# EasyEDA Pro project ProPrj_AS5047P磁编码器板(For3505电机_2026-04-13.epro

# Schematic Schematic1
Board Name: Board1; Create Date: 2024-10-22; Page Name: P1; Project Name: AS5047P磁编码器板(For3505电机; Schematic Name: Schematic1; Update Date: 2024-10-22; Company: 嘉立创EDA; Page Size: A4; Version: V1.0
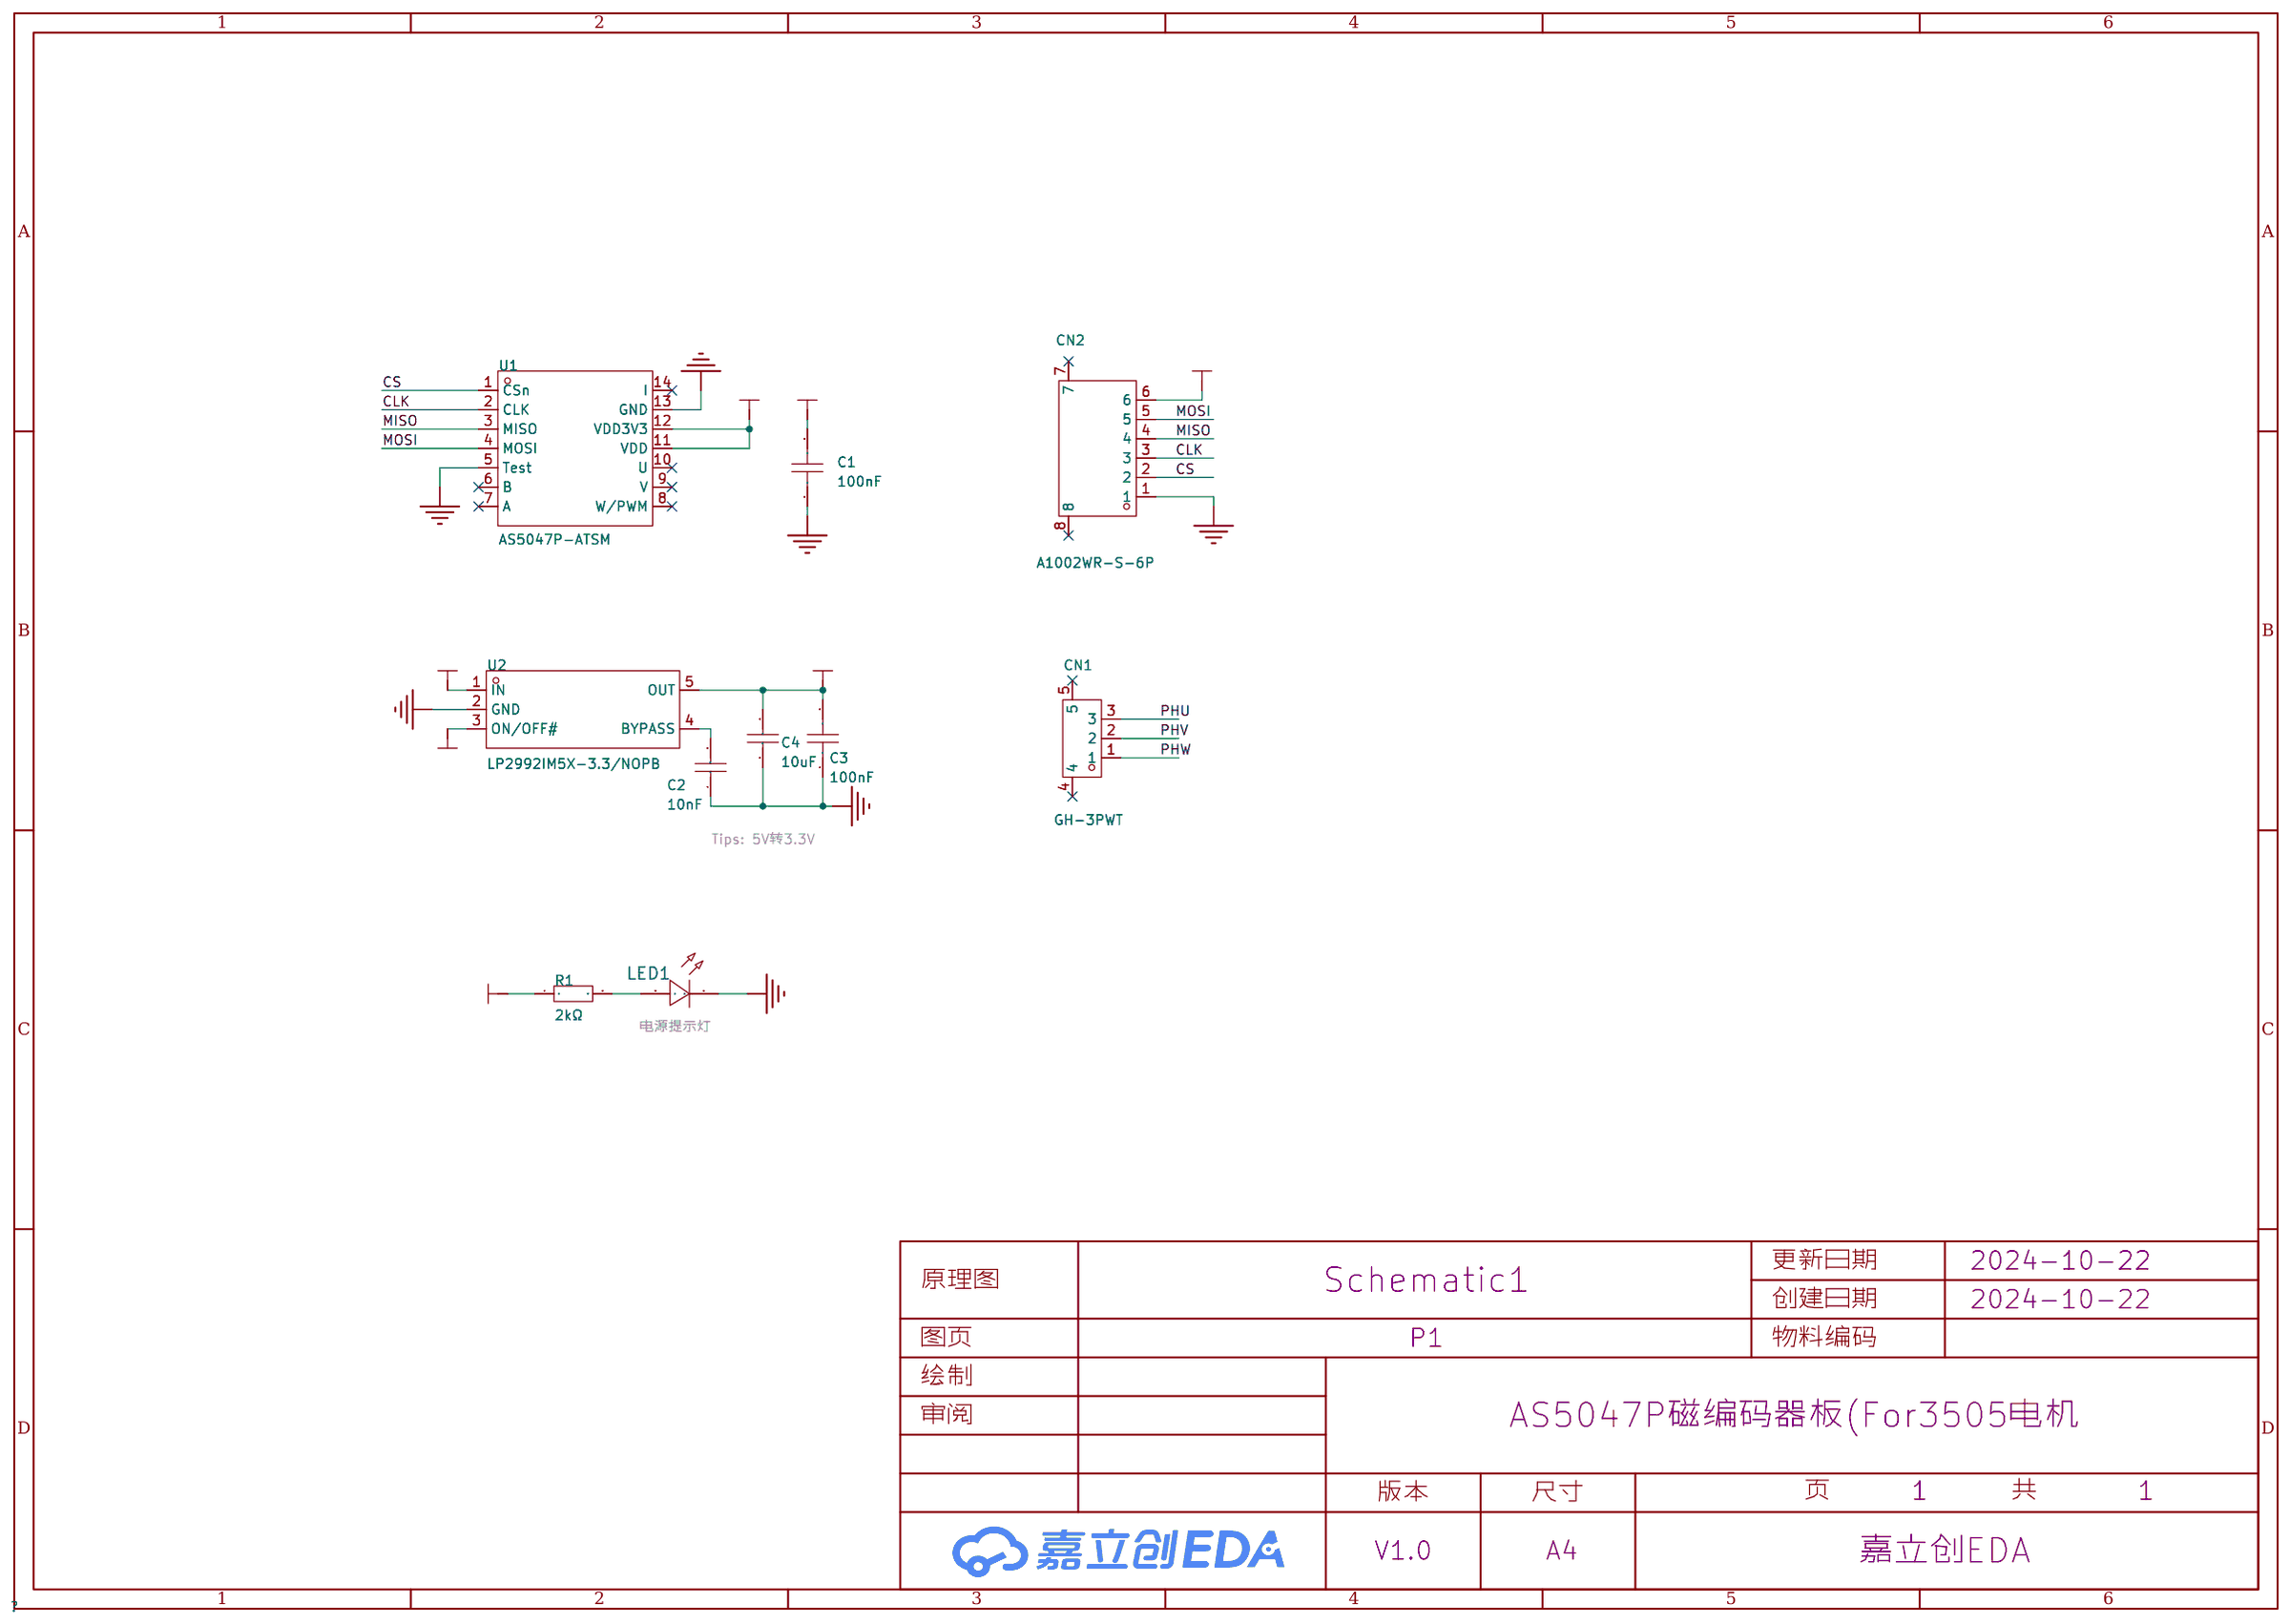
[diagram p0: schematic sheet]

## Parts
C1  100nF  [C0402]
C2  10nF  [C0402]
C3  100nF  [C0402]
C4  10uF  [C0402]
CN1  GH-3PWT  [conn-smd_gh-3pwt]
CN2  A1002WR-S-6P  [CONN-SMD_A1002WR-S-6P]
LED1  -  [LED_0603]
R1  2kΩ  [R0402]
U1  AS5047P-ATSM  [TSSOP-14_L5.0-W4.4-P0.65-LS6.4-BL]
U2  LP2992IM5X-3.3/NOPB  [SOT-23-5_L2.9-W1.6-P0.95-LS2.8-BR]

## Library data of the parts
C1 C3 = CL05B104KO5NNNC: 容值:100nF;精度:±10%;额定电压:16V;材质(温度系数):X7R;; LCSC Part Name: 100nF ±10% 16V; Supplier Part: C1525; Manufacturer: SAMSUNG(三星); Supplier Footprint: 0402; JLCPCB Part Class: 基础库; Datasheet: https://atta.szlcsc.com/upload/public/pdf/source/20160218/1457707763339.pdf; Supplier: LCSC; Tolerance: ±10%; Voltage Rated: 16V; Temperature Coefficient: X7R
C2 = CL05B103KB5NNNC: 容值:10nF;精度:±10%;额定电压:50V;材质(温度系数):X7R;; LCSC Part Name: 10nF ±10% 50V; Supplier Part: C15195; Manufacturer: SAMSUNG(三星); Supplier Footprint: 0402; Datasheet: https://atta.szlcsc.com/upload/public/pdf/source/20160218/1457707763339.pdf; Supplier: LCSC; Tolerance: ±10%; Voltage Rated: 50V; Temperature Coefficient: X7R
C4 = CL05A106MQ5NUNC: 容值:10uF;精度:±20%;额定电压:6.3V;材质(温度系数):X5R;; LCSC Part Name: 10uF ±20% 6.3V; Supplier Part: C15525; Manufacturer: SAMSUNG(三星); Supplier Footprint: 0402; JLCPCB Part Class: 基础库; Datasheet: https://atta.szlcsc.com/upload/public/pdf/source/20220823/2B02EE04F8F211D38A52DCB16EB6BEBA.pdf; Supplier: LCSC; Tolerance: ±20%; Voltage Rated: 6.3V; Temperature Coefficient: X5R
CN1 = GH-3PWT: LCSC Part Name: 3P 1.25mm; Supplier Part: C2763649; Manufacturer: FG(富港); Supplier Footprint: SMD; JLCPCB Part Class: 扩展库; Datasheet: https://atta.szlcsc.com/upload/public/pdf/source/20210407/C2763648_564FED8A0440C1CEC0901E8305E0E977.pdf; Supplier: LCSC
CN2 = A1002WR-S-6P: 参考系列:SH;间距:1mm;插针结构:1x6P;排数:1;每排PIN数:6;行距:-;安装方式:-;触头材质:磷青铜;; LCSC Part Name: SH 1mm 1x6P; Supplier Part: C239524; Manufacturer: CJT(长江连接器); Supplier Footprint: SMD,P=1mm; JLCPCB Part Class: 扩展库; Datasheet: https://atta.szlcsc.com/upload/public/pdf/source/20190523/C338919_26A19BC9BEDA3DBF5CB743676AAF20C3.pdf; Supplier: LCSC; Reference Series: SH; Pitch: 1mm; Pins Structure: 1x6P; Number of Rows: 1; Number of PINs Per Row: 6; Contact Material: 磷青铜
LED1 = LED_0603-R: Supplier Footprint: 0603
R1 = 0402WGF2001TCE: 电阻类型:厚膜电阻;阻值:2kΩ;精度:±1%;功率:62.5mW;最大工作电压:50V;温度系数:±100ppm/℃;; LCSC Part Name: 2kΩ ±1% 62.5mW 厚膜电阻; Supplier Part: C4109; Manufacturer: UNI-ROYAL(厚声); Supplier Footprint: 0402; JLCPCB Part Class: 基础库; Datasheet: https://atta.szlcsc.com/upload/public/pdf/source/20200306/C422600_1E6D84923E4A46A82E41ADD87F860B5C.pdf; Supplier: LCSC; Type: 厚膜电阻; Tolerance: ±1%; Power(Watts): 62.5mW; Overload Voltage (Max): 50V; Temperature Coefficient: ±100ppm/℃; Operating Temperature Range: -55℃~+155℃
U1 = AS5047P-ATSM_C962063: Supplier Part: C962063; Manufacturer: ams(艾迈斯半导体); Supplier Footprint: TSSOP-14; JLCPCB Part Class: 扩展库; Datasheet: https://atta.szlcsc.com/upload/public/pdf/source/20230424/95EDFD761CCFD379FE860E4B35935AF0.pdf; Supplier: LCSC
U2 = LP2992IM5X-3.3/NOPB: 微功耗 250mA 低噪声超低压降稳压器 5-SOT-23 -40 to 125; Supplier Part: C2877731; Manufacturer: TI(德州仪器); Supplier Footprint: SOT-23-5; JLCPCB Part Class: 扩展库; Datasheet: https://atta.szlcsc.com/upload/public/pdf/source/20230221/4F3FB37702A60F10FC19CD69011A6AB4.pdf; Supplier: LCSC

## Nets
3.3V: C1.2 C3.2 C4.2 R1.1 U1.11(VDD) U1.12(VDD3V3) U2.5(OUT)
5V: CN2.6 U2.1(IN) U2.3(ON/OFF#)
GND: C1.1 C2.1 C3.1 C4.1 CN2.1 LED1.1(C) U1.5(Test) U1.13(GND) U2.2(GND)
CLK: CN2.3 U1.2(CLK)
CS: CN2.2 U1.1(CSn)
MISO: CN2.4 U1.3(MISO)
MOSI: CN2.5 U1.4(MOSI)
PHU: CN1.3
PHV: CN1.2
PHW: CN1.1
$1N873: C2.2 U2.4(BYPASS)
$1N1089: LED1.2(A) R1.2

Not connected (* = marked no-connect by the designer): CN1 4* 5*; CN2 7* 8*; U1 6(B)* 7(A)* 8(W/PWM)* 9(V)* 10(U)* 14(I)*

## Notes on the sheet
- Tips: 5V转3.3V
- 电源提示灯

# Schematic Schematic2
Board Name: Board1; Create Date: 2024-10-22; Page Name: P1; Project Name: AS5047P磁编码器板(For3505电机; Schematic Name: Schematic1; Update Date: 2024-10-22; Company: 嘉立创EDA; Page Size: A4; Version: V1.0
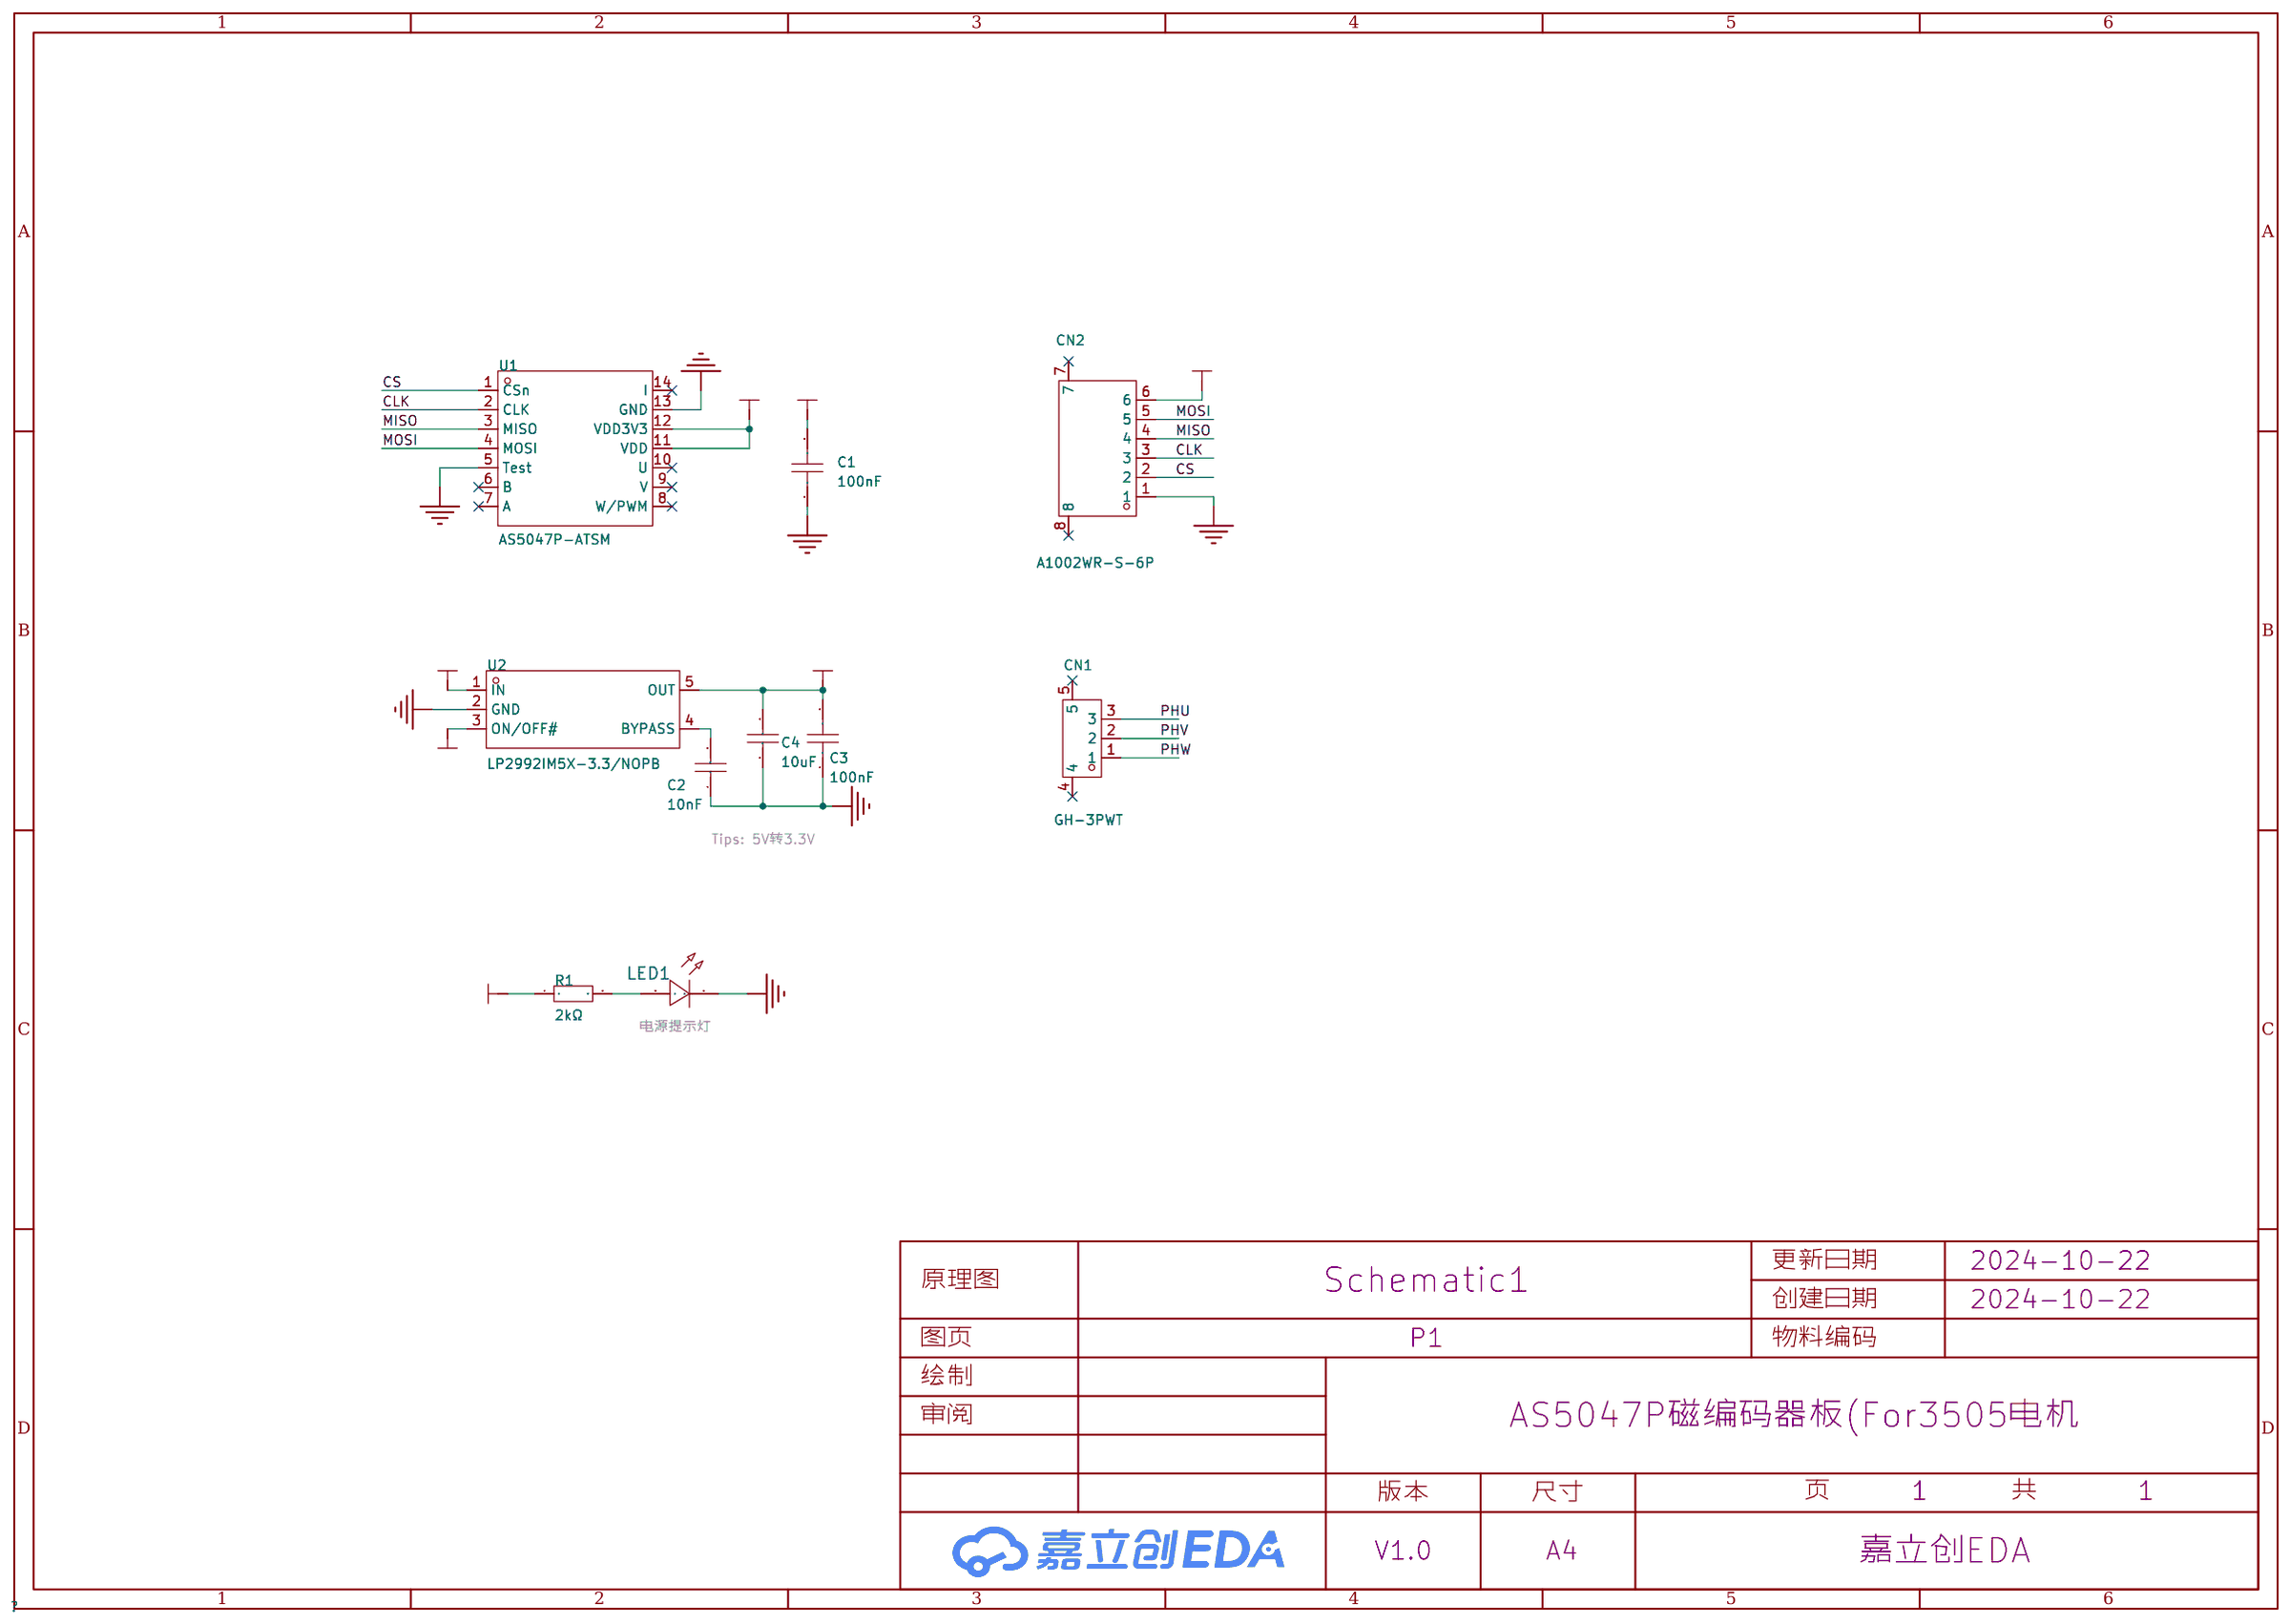
[diagram p1: schematic sheet]

## Parts
C1  100nF  [C0402]
C2  10nF  [C0402]
C3  100nF  [C0402]
C4  10uF  [C0402]
CN1  GH-3PWT  [conn-smd_gh-3pwt]
CN2  A1002WR-S-6P  [CONN-SMD_A1002WR-S-6P]
LED1  -  [LED_0603]
R1  2kΩ  [R0402]
U1  AS5047P-ATSM  [TSSOP-14_L5.0-W4.4-P0.65-LS6.4-BL]
U2  LP2992IM5X-3.3/NOPB  [SOT-23-5_L2.9-W1.6-P0.95-LS2.8-BR]

## Library data of the parts
C1 C3 = CL05B104KO5NNNC: 容值:100nF;精度:±10%;额定电压:16V;材质(温度系数):X7R;; LCSC Part Name: 100nF ±10% 16V; Supplier Part: C1525; Manufacturer: SAMSUNG(三星); Supplier Footprint: 0402; JLCPCB Part Class: 基础库; Datasheet: https://atta.szlcsc.com/upload/public/pdf/source/20160218/1457707763339.pdf; Supplier: LCSC; Tolerance: ±10%; Voltage Rated: 16V; Temperature Coefficient: X7R
C2 = CL05B103KB5NNNC: 容值:10nF;精度:±10%;额定电压:50V;材质(温度系数):X7R;; LCSC Part Name: 10nF ±10% 50V; Supplier Part: C15195; Manufacturer: SAMSUNG(三星); Supplier Footprint: 0402; Datasheet: https://atta.szlcsc.com/upload/public/pdf/source/20160218/1457707763339.pdf; Supplier: LCSC; Tolerance: ±10%; Voltage Rated: 50V; Temperature Coefficient: X7R
C4 = CL05A106MQ5NUNC: 容值:10uF;精度:±20%;额定电压:6.3V;材质(温度系数):X5R;; LCSC Part Name: 10uF ±20% 6.3V; Supplier Part: C15525; Manufacturer: SAMSUNG(三星); Supplier Footprint: 0402; JLCPCB Part Class: 基础库; Datasheet: https://atta.szlcsc.com/upload/public/pdf/source/20220823/2B02EE04F8F211D38A52DCB16EB6BEBA.pdf; Supplier: LCSC; Tolerance: ±20%; Voltage Rated: 6.3V; Temperature Coefficient: X5R
CN1 = GH-3PWT: LCSC Part Name: 3P 1.25mm; Supplier Part: C2763649; Manufacturer: FG(富港); Supplier Footprint: SMD; JLCPCB Part Class: 扩展库; Datasheet: https://atta.szlcsc.com/upload/public/pdf/source/20210407/C2763648_564FED8A0440C1CEC0901E8305E0E977.pdf; Supplier: LCSC
CN2 = A1002WR-S-6P: 参考系列:SH;间距:1mm;插针结构:1x6P;排数:1;每排PIN数:6;行距:-;安装方式:-;触头材质:磷青铜;; LCSC Part Name: SH 1mm 1x6P; Supplier Part: C239524; Manufacturer: CJT(长江连接器); Supplier Footprint: SMD,P=1mm; JLCPCB Part Class: 扩展库; Datasheet: https://atta.szlcsc.com/upload/public/pdf/source/20190523/C338919_26A19BC9BEDA3DBF5CB743676AAF20C3.pdf; Supplier: LCSC; Reference Series: SH; Pitch: 1mm; Pins Structure: 1x6P; Number of Rows: 1; Number of PINs Per Row: 6; Contact Material: 磷青铜
LED1 = LED_0603-R: Supplier Footprint: 0603
R1 = 0402WGF2001TCE: 电阻类型:厚膜电阻;阻值:2kΩ;精度:±1%;功率:62.5mW;最大工作电压:50V;温度系数:±100ppm/℃;; LCSC Part Name: 2kΩ ±1% 62.5mW 厚膜电阻; Supplier Part: C4109; Manufacturer: UNI-ROYAL(厚声); Supplier Footprint: 0402; JLCPCB Part Class: 基础库; Datasheet: https://atta.szlcsc.com/upload/public/pdf/source/20200306/C422600_1E6D84923E4A46A82E41ADD87F860B5C.pdf; Supplier: LCSC; Type: 厚膜电阻; Tolerance: ±1%; Power(Watts): 62.5mW; Overload Voltage (Max): 50V; Temperature Coefficient: ±100ppm/℃; Operating Temperature Range: -55℃~+155℃
U1 = AS5047P-ATSM_C962063: Supplier Part: C962063; Manufacturer: ams(艾迈斯半导体); Supplier Footprint: TSSOP-14; JLCPCB Part Class: 扩展库; Datasheet: https://atta.szlcsc.com/upload/public/pdf/source/20230424/95EDFD761CCFD379FE860E4B35935AF0.pdf; Supplier: LCSC
U2 = LP2992IM5X-3.3/NOPB: 微功耗 250mA 低噪声超低压降稳压器 5-SOT-23 -40 to 125; Supplier Part: C2877731; Manufacturer: TI(德州仪器); Supplier Footprint: SOT-23-5; JLCPCB Part Class: 扩展库; Datasheet: https://atta.szlcsc.com/upload/public/pdf/source/20230221/4F3FB37702A60F10FC19CD69011A6AB4.pdf; Supplier: LCSC

## Nets
3.3V: C1.2 C3.2 C4.2 R1.1 U1.11(VDD) U1.12(VDD3V3) U2.5(OUT)
5V: CN2.6 U2.1(IN) U2.3(ON/OFF#)
GND: C1.1 C2.1 C3.1 C4.1 CN2.1 LED1.1(C) U1.5(Test) U1.13(GND) U2.2(GND)
CLK: CN2.3 U1.2(CLK)
CS: CN2.2 U1.1(CSn)
MISO: CN2.4 U1.3(MISO)
MOSI: CN2.5 U1.4(MOSI)
PHU: CN1.3
PHV: CN1.2
PHW: CN1.1
$1N873: C2.2 U2.4(BYPASS)
$1N1089: LED1.2(A) R1.2

Not connected (* = marked no-connect by the designer): CN1 4* 5*; CN2 7* 8*; U1 6(B)* 7(A)* 8(W/PWM)* 9(V)* 10(U)* 14(I)*

## Notes on the sheet
- Tips: 5V转3.3V
- 电源提示灯

# Board PCB2
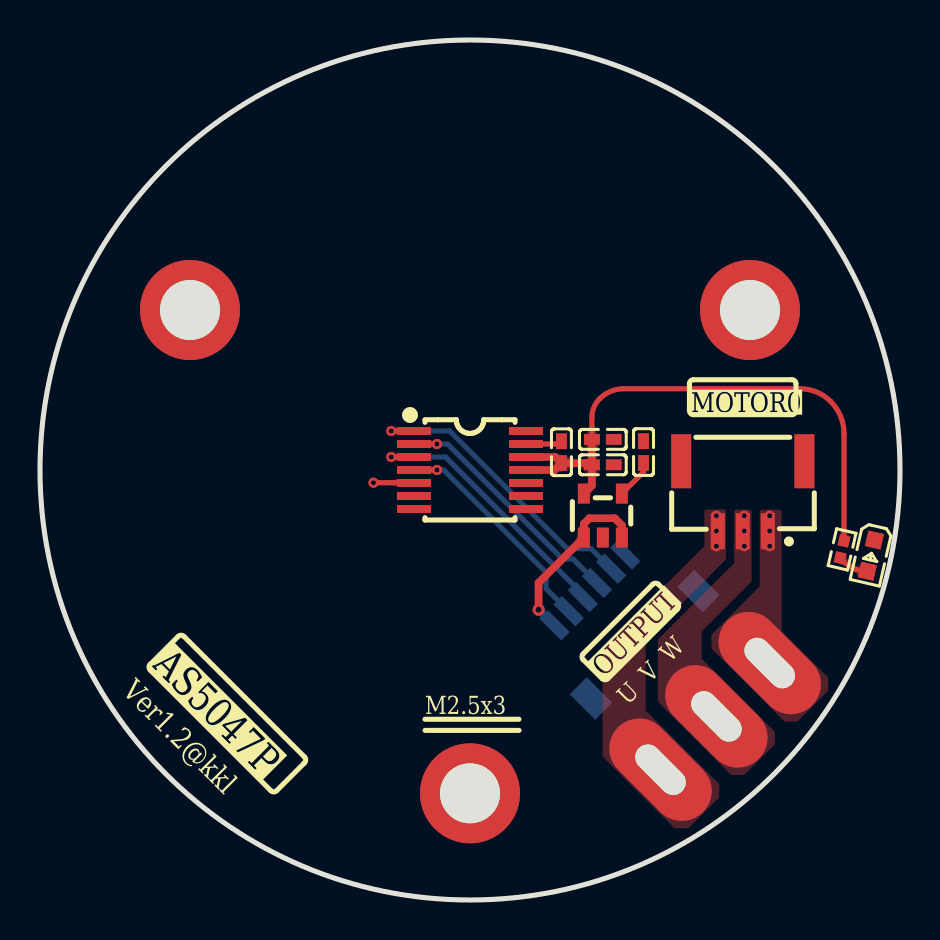
[diagram p2: board, top side]
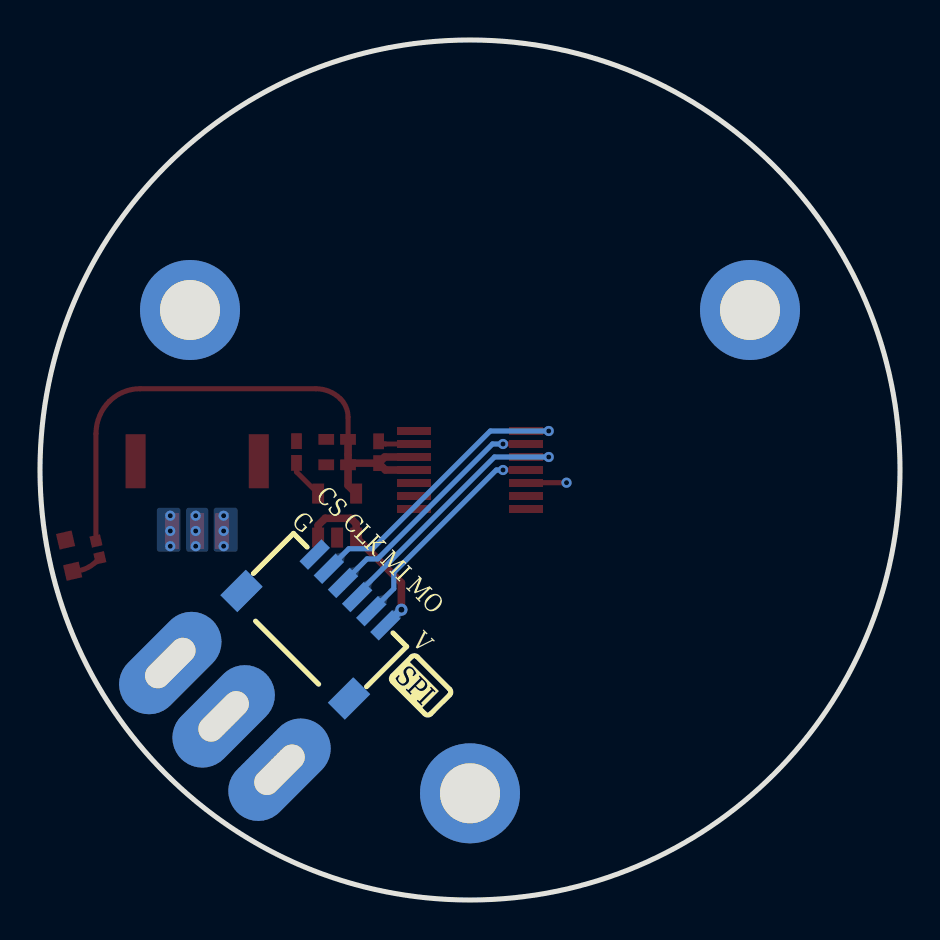
[diagram p3: board, bottom side, seen from below]

Outline 43 x 43 mm; copper layers: Top Layer, Bottom Layer. Coordinates in mm from the lower left corner of the outline.
Outline path: circle c21.5,21.5 r21.5
Stack: Top Layer 0.035mm / Dielectric1 1.51mm FR4 er 4.5 / Bottom Layer 0.035mm

## Design rules (mm)
template: 自定义配置
spacing copperThickness1oz (default): track to track 0.102, other pairs 0.152 to 0.3
spacing copperThickness2oz: track to track 0.203, other pairs 0.152 to 0.3
track width copperThickness1oz (default): min 0.127, default 0.254, max 2.54
track width copperThickness2oz: min 0.203, default 0.254, max 2.54
differential pair differentialPair (default): width min 0.127, default 0.254, max 2.54; gap min 0.152, default 0.152
via viaSize (default): diameter min 0.508, default 0.508, max 10; hole min 0.254, default 0.254, max 6.299
net PHU uses copperAll
net PHV uses copperAll
net PHW uses copperAll
pour e62 uses copperAll
pour e235 uses copperAll

## Placement (name value [footprint] x y rotation side)
C1  100nF  [C0402]  26.07 22.39 270 top
C2  10nF  [C0402]  30.18 22.4 270 top
C3  100nF  [C0402]  28.14 23.03 180 top
C4  10uF  [C0402]  28.14 21.76 180 top
CN1  GH-3PWT  [conn-smd_gh-3pwt]  35.14 20.19 180 top
CN2  A1002WR-S-6P  [CONN-SMD_A1002WR-S-6P]  28.87 14.13 225 bottom
LED1  -  [LED_0603]  41.54 17.17 257 top
NOREF  -  [Pad_e24]  7.5 29.5 270 top
NOREF#2  -  [Pad_ie21]  31.03 6.51 45 top
NOREF#3  -  [Pad_e27]  21.5 5.33 270 top
NOREF#4  -  [Pad_ie23]  36.49 11.85 45 top
NOREF#5  -  [Pad_ie22]  33.82 9.18 45 top
NOREF#6  -  [Pad_e55]  35.5 29.5 270 top
R1  2kΩ  [R0402]  40.1 17.53 257 top
U1  AS5047P-ATSM  [TSSOP-14_L5.0-W4.4-P0.65-LS6.4-BL]  21.5 21.5 270 top
U2  LP2992IM5X-3.3/NOPB  [SOT-23-5_L2.9-W1.6-P0.95-LS2.8-BR]  28.14 19.22 270 top

## Footprints (pads in the part's own frame, mm; a bottom-side part is the same pattern mirrored in y, then rotated)
C0402
  rect 0.79x0.54 smd: 1(-0.545,0) 2(0.545,0)
CONN-SMD_A1002WR-S-6P
  rect 0.6x1.55 smd: 1(-2.501,1.938) 2(-1.5,1.938) 3(-0.497,1.936) 4(0.501,1.937) 5(1.502,1.937) 6(2.502,1.937)
  rect 1.2x1.8 smd: 7(3.801,-1.938) 8(-3.801,-1.937)
conn-smd_gh-3pwt
  rect 0.7x1.8 smd: 1(-1.25,1.75) 2(0,1.75) 3(1.25,1.75)
  rect 1x2.7 smd: 4(-3.08,-1.75) 5(3.08,-1.75)
LED_0603
  rect 0.8x0.8 smd: 1(-0.851,-0.01) 2(0.75,-0.005)
Pad_e24
  oval 5x5 hole 3: 9(0,0)
Pad_e27
  oval 5x5 hole 3: 9(0,0)
Pad_e55
  oval 5x5 hole 3: 9(0,0)
Pad_ie21
  rrect 3x6 hole 1.27x3.048: (0,0)
Pad_ie22
  rrect 3x6 hole 1.27x3.048: (0,0)
Pad_ie23
  rrect 3x6 hole 1.27x3.048: (0,0)
R0402
  rect 0.566x0.54 smd: 1(-0.433,0) 2(0.433,0)
SOT-23-5_L2.9-W1.6-P0.95-LS2.8-BR
  rect 1x0.6 smd: 1(1.1,-0.95) 2(1.1,0) 3(1.1,0.95) 4(-1.1,0.95) 5(-1.1,-0.95)
TSSOP-14_L5.0-W4.4-P0.65-LS6.4-BL
  rect 0.4x1.7 smd: 1(-1.95,-2.8) 2(-1.3,-2.8) 3(-0.65,-2.8) 4(0,-2.8) 5(0.65,-2.8) 6(1.3,-2.8) 7(1.95,-2.8) 8(1.95,2.8) 9(1.3,2.8) 10(0.65,2.8) 11(0,2.8) 12(-0.65,2.8) 13(-1.3,2.8) 14(-1.95,2.8)

## Nets
3.3V: C1.2 C3.2 C4.2 R1.1 U1.11 U1.12 U2.5
5V: CN2.6 U2.1 U2.3
GND: C1.1 C2.1 C3.1 C4.1 CN2.1 LED1.1 U1.5 U1.13 U2.2
CLK: CN2.3 U1.2
CS: CN2.2 U1.1
MISO: CN2.4 U1.3
MOSI: CN2.5 U1.4
PHU: CN1.3 NOREF#2.
PHV: CN1.2 NOREF#5.
PHW: CN1.1 NOREF#4.
$1N873: C2.2 U2.4
$1N1089: LED1.2 R1.2

Pads without a net: CN1 4 5; CN2 7 8; NOREF 9; NOREF#3 9; NOREF#6 9; U1 6 7 8 9 10 14

## Via types
v1: diameter 0.508, hole 0.254, Top Layer to Bottom Layer, 14 vias
v2: diameter 0.61, hole 0.305, Top Layer to Bottom Layer, 1 via

## Routing (per net, layer and track width the routed paths; a pad name or vN(x,y) marks a point on that pad's centre or on a via; arc(x,y) is an arc through that point)
3.3V: length 29.4
  Top Layer w0.254: C3.2 27.6,24.14 arc(27.7,24.64) 27.98,25.06 arc(28.54,25.43) 29.2,25.56 38,25.56 arc(38.83,25.4) 39.53,24.93 arc(40.03,24.19) 40.2,23.32 R1.1
  Top Layer w0.381: U1.12 25.77,22.15 C1.2 ; C4.2 C3.2 ; C4.2 27.6,20.73 U2.5 ; C4.2 27.51,21.84 C1.2 ; C1.2 25.73,21.5 U1.11
5V: length 9.1
  Top Layer w0.381: v2(24.93,14.52) 24.93,15.86 27.19,18.12 27.19,18.81 27.47,19.09 28.74,19.09 29.09,18.73 29.09,18.12
  Bottom Layer w0.381: v2(24.93,14.52) 24.95,14.52 25.73,13.73
GND: length 3.8
  Top Layer w0.254: v1(16.67,20.86) 18.66,20.86 arc(18.68,20.86) U1.5 ; U1.13 25.75,22.8 arc(25.92,22.83) C1.1
CLK: length 12
  Top Layer w0.254: U1.2 v1(19.85,22.8)
  Bottom Layer w0.254: 27.85,15.86 26.65,17.06 26.12,17.06 20.38,22.8 v1(19.85,22.8)
CS: length 15
  Top Layer w0.254: U1.1 v1(17.56,23.45)
  Bottom Layer w0.254: v1(17.56,23.45) 20.48,23.45 26.37,17.56 27.56,17.56 CN2.2
MISO: length 13.7
  Top Layer w0.254: U1.3 v1(17.56,22.15)
  Bottom Layer w0.254: v1(17.56,22.15) 20.28,22.15 27.14,15.28 27.14,15.15
MOSI: length 11.1
  Top Layer w0.254: U1.4 v1(19.85,21.5)
  Bottom Layer w0.254: v1(19.85,21.5) 20.19,21.5 25.31,16.38 25.31,15.57 CN2.5
PHU:
  vias: v1(33.82,19.21) v1(33.82,18.45) v1(33.82,17.69)
PHV:
  vias: v1(35.22,19.21) v1(35.22,18.45) v1(35.22,17.69)
PHW:
  vias: v1(36.49,19.21) v1(36.49,18.45) v1(36.49,17.69)
$1N873: length 2
  Top Layer w0.254: C2.2 30.18,21.4 U2.4
$1N1089: length 1.6
  Top Layer w0.254: R1.2 40.19,16.92 arc(40.73,16.56) LED1.2

## Copper pours and planes (outline as drawn; the poured copper is in the pictures)
GND on Top Layer: -4.03,46.14 45.25,46.14 45.25,-2.12 -4.03,-2.12
GND on Bottom Layer: -1.23,50.33 49.44,50.33 49.44,-6.69 -1.23,-6.69
PHU on Top Layer: 33.22,19.52 34.3,19.52 34.3,17.03 30.28,13.02 30.28,9.47 33.96,5.8 33.96,5.13 32.42,3.59 31.72,3.59 28.13,7.18 28.13,12.61 33.22,17.71
PHU on Bottom Layer: 33.12,19.49 33.13,19.54 33.15,19.58 33.19,19.61 33.24,19.61 34.19,19.61 34.24,19.61 34.28,19.58 34.31,19.54 34.32,19.49 34.32,17.54 34.31,17.49 34.28,17.45 34.24,17.43 34.19,17.42 33.24,17.42 33.19,17.43 33.15,17.45 33.13,17.49 33.12,17.54
PHV on Top Layer: 34.71,19.52 35.58,19.52 35.58,15.94 33.08,13.44 33.08,12.08 36.74,8.42 36.74,7.79 35.2,6.25 34.55,6.25 30.89,9.91 30.89,13.02 34.71,16.84
PHV on Bottom Layer: 34.59,19.48 34.6,19.53 34.63,19.57 34.67,19.6 34.72,19.61 35.56,19.61 35.61,19.6 35.65,19.57 35.68,19.53 35.69,19.48 35.69,17.54 35.68,17.49 35.65,17.45 35.61,17.42 35.56,17.41 34.72,17.41 34.67,17.42 34.63,17.45 34.6,17.49 34.59,17.54
PHW on Top Layer: 35.99,19.52 37.07,19.52 37.07,13.46 39.41,11.12 39.41,10.47 37.87,8.93 37.22,8.93 33.57,12.58 33.57,13.26 35.99,15.68
PHW on Bottom Layer: 35.98,19.48 35.99,19.53 36.02,19.57 36.06,19.6 36.11,19.61 37.03,19.61 37.08,19.6 37.12,19.57 37.15,19.53 37.16,19.48 37.16,17.54 37.15,17.49 37.12,17.45 37.08,17.42 37.03,17.41 36.11,17.41 36.06,17.42 36.02,17.45 35.99,17.49 35.98,17.54

Small or netless copper shapes (teardrops, artwork), in the pictures only: 30 on Top Layer, 10 on Bottom Layer

## Text on the board
Bottom Silkscreen Layer: V | CS CLK MI MO | G | SPI
Top Silkscreen Layer: U  V  W | M2.5x3 | OUTPUT | MOTOR0 | Ver1.2@kkl | AS5047P

# Board PCB1
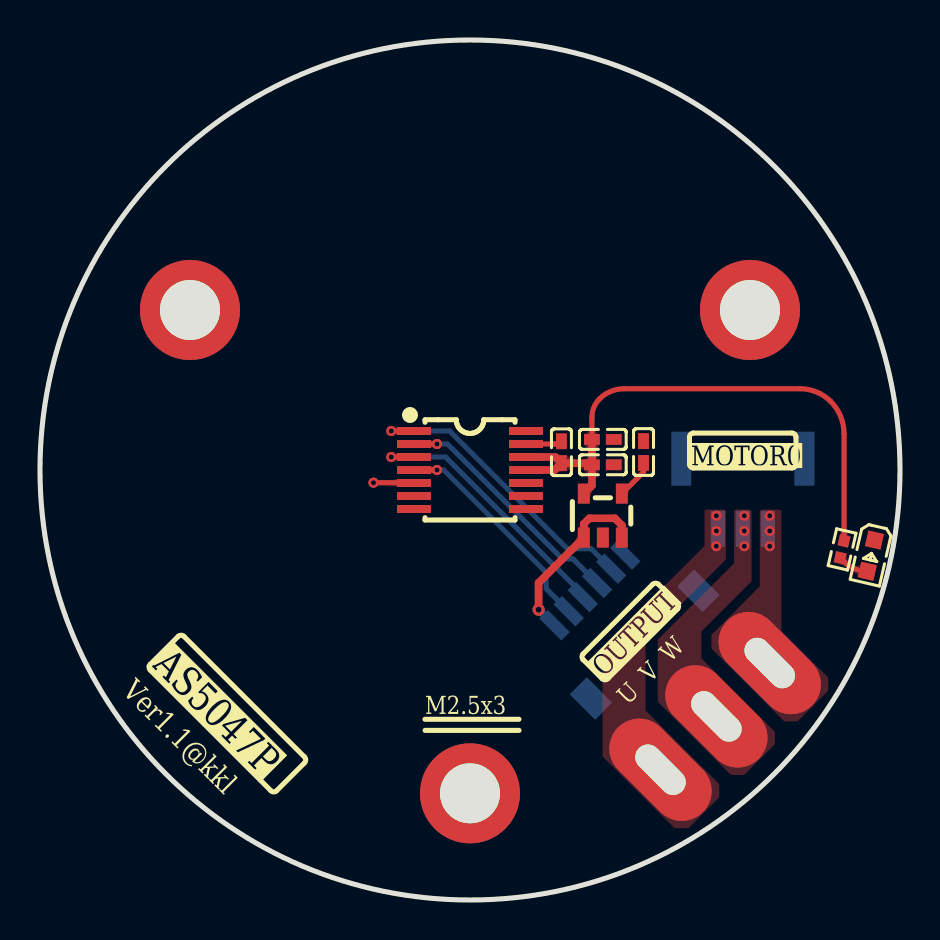
[diagram p4: board, top side]
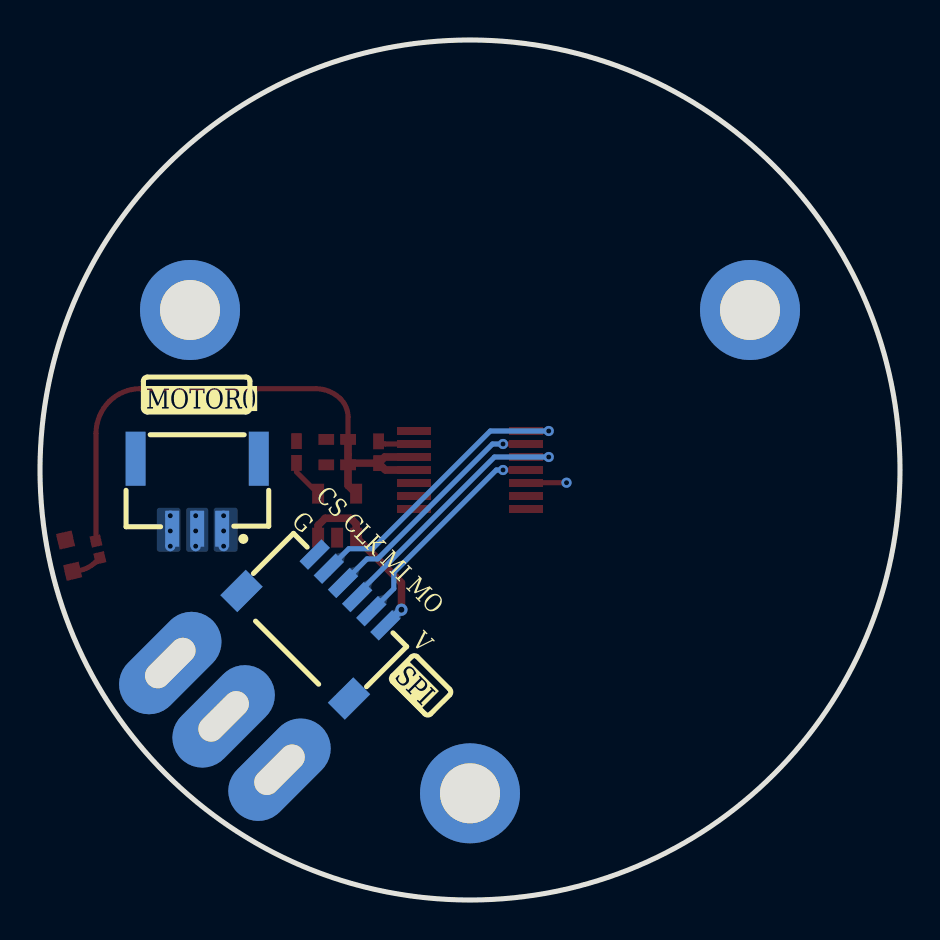
[diagram p5: board, bottom side, seen from below]

Outline 43 x 43 mm; copper layers: Top Layer, Bottom Layer. Coordinates in mm from the lower left corner of the outline.
Outline path: circle c21.5,21.5 r21.5
Stack: Top Layer 0.035mm / Dielectric1 1.51mm FR4 er 4.5 / Bottom Layer 0.035mm

## Design rules (mm)
template: 自定义配置
spacing copperThickness1oz (default): track to track 0.102, other pairs 0.152 to 0.3
spacing copperThickness2oz: track to track 0.203, other pairs 0.152 to 0.3
track width copperThickness1oz (default): min 0.127, default 0.254, max 2.54
track width copperThickness2oz: min 0.203, default 0.254, max 2.54
differential pair differentialPair (default): width min 0.127, default 0.254, max 2.54; gap min 0.152, default 0.152
via viaSize (default): diameter min 0.508, default 0.508, max 10; hole min 0.254, default 0.254, max 6.299
net PHU uses copperAll
net PHV uses copperAll
net PHW uses copperAll
pour e62 uses copperAll
pour e235 uses copperAll

## Placement (name value [footprint] x y rotation side)
C1  100nF  [C0402]  26.07 22.39 270 top
C2  10nF  [C0402]  30.18 22.4 270 top
C3  100nF  [C0402]  28.14 23.03 180 top
C4  10uF  [C0402]  28.14 21.76 180 top
CN1  GH-3PWT  [conn-smd_gh-3pwt]  35.14 20.31 0 bottom
CN2  A1002WR-S-6P  [CONN-SMD_A1002WR-S-6P]  28.87 14.13 225 bottom
LED1  -  [LED_0603]  41.54 17.17 257 top
NOREF  -  [Pad_ie23]  36.49 11.85 45 top
NOREF#2  -  [Pad_e24]  7.5 29.5 270 top
NOREF#3  -  [Pad_e27]  21.5 5.33 270 top
NOREF#4  -  [Pad_e55]  35.5 29.5 270 top
NOREF#5  -  [Pad_ie21]  31.03 6.51 45 top
NOREF#6  -  [Pad_ie22]  33.82 9.18 45 top
R1  2kΩ  [R0402]  40.1 17.53 257 top
U1  AS5047P-ATSM  [TSSOP-14_L5.0-W4.4-P0.65-LS6.4-BL]  21.5 21.5 270 top
U2  LP2992IM5X-3.3/NOPB  [SOT-23-5_L2.9-W1.6-P0.95-LS2.8-BR]  28.14 19.22 270 top

## Footprints (pads in the part's own frame, mm; a bottom-side part is the same pattern mirrored in y, then rotated)
C0402
  rect 0.79x0.54 smd: 1(-0.545,0) 2(0.545,0)
CONN-SMD_A1002WR-S-6P
  rect 0.6x1.55 smd: 1(-2.501,1.938) 2(-1.5,1.938) 3(-0.497,1.936) 4(0.501,1.937) 5(1.502,1.937) 6(2.502,1.937)
  rect 1.2x1.8 smd: 7(3.801,-1.938) 8(-3.801,-1.937)
conn-smd_gh-3pwt
  rect 0.7x1.8 smd: 1(-1.25,1.75) 2(0,1.75) 3(1.25,1.75)
  rect 1x2.7 smd: 4(-3.08,-1.75) 5(3.08,-1.75)
LED_0603
  rect 0.8x0.8 smd: 1(-0.851,-0.01) 2(0.75,-0.005)
Pad_e24
  round 5 hole 3: 9(0,0)
Pad_e27
  oval 5x5 hole 3: 9(0,0)
Pad_e55
  oval 5x5 hole 3: 9(0,0)
Pad_ie21
  rrect 3x6 hole 1.27x3.048: (0,0)
Pad_ie22
  rrect 3x6 hole 1.27x3.048: (0,0)
Pad_ie23
  rrect 3x6 hole 1.27x3.048: (0,0)
R0402
  rect 0.566x0.54 smd: 1(-0.433,0) 2(0.433,0)
SOT-23-5_L2.9-W1.6-P0.95-LS2.8-BR
  rect 1x0.6 smd: 1(1.1,-0.95) 2(1.1,0) 3(1.1,0.95) 4(-1.1,0.95) 5(-1.1,-0.95)
TSSOP-14_L5.0-W4.4-P0.65-LS6.4-BL
  rect 0.4x1.7 smd: 1(-1.95,-2.8) 2(-1.3,-2.8) 3(-0.65,-2.8) 4(0,-2.8) 5(0.65,-2.8) 6(1.3,-2.8) 7(1.95,-2.8) 8(1.95,2.8) 9(1.3,2.8) 10(0.65,2.8) 11(0,2.8) 12(-0.65,2.8) 13(-1.3,2.8) 14(-1.95,2.8)

## Nets
3.3V: C1.2 C3.2 C4.2 R1.1 U1.11 U1.12 U2.5
5V: CN2.6 U2.1 U2.3
GND: C1.1 C2.1 C3.1 C4.1 CN2.1 LED1.1 U1.5 U1.13 U2.2
CLK: CN2.3 U1.2
CS: CN2.2 U1.1
MISO: CN2.4 U1.3
MOSI: CN2.5 U1.4
PHU: CN1.3 NOREF.
PHV: CN1.2 NOREF#6.
PHW: CN1.1 NOREF#5.
$1N873: C2.2 U2.4
$1N1089: LED1.2 R1.2

Pads without a net: CN1 4 5; CN2 7 8; NOREF#2 9; NOREF#3 9; NOREF#4 9; U1 6 7 8 9 10 14

## Via types
v1: diameter 0.508, hole 0.254, Top Layer to Bottom Layer, 14 vias
v2: diameter 0.61, hole 0.305, Top Layer to Bottom Layer, 1 via

## Routing (per net, layer and track width the routed paths; a pad name or vN(x,y) marks a point on that pad's centre or on a via; arc(x,y) is an arc through that point)
3.3V: length 29.4
  Top Layer w0.254: R1.1 40.2,23.32 arc(40.03,24.19) 39.53,24.93 arc(38.83,25.4) 38,25.56 29.2,25.56 arc(28.54,25.43) 27.98,25.06 arc(27.7,24.64) 27.6,24.14 C3.2
  Top Layer w0.381: C4.2 27.51,21.84 C1.2 ; C4.2 27.6,20.73 U2.5 ; C4.2 C3.2 ; C1.2 25.77,22.15 U1.12 ; C1.2 25.73,21.5 U1.11
5V: length 9.1
  Top Layer w0.381: v2(24.93,14.52) 24.93,15.86 27.19,18.12 27.19,18.81 27.47,19.09 28.74,19.09 29.09,18.73 29.09,18.12
  Bottom Layer w0.381: 25.73,13.73 24.95,14.52 v2(24.93,14.52)
GND: length 3.8
  Top Layer w0.254: v1(16.67,20.86) 18.66,20.86 arc(18.68,20.86) U1.5 ; U1.13 25.75,22.8 arc(25.92,22.83) C1.1
CLK: length 12
  Top Layer w0.254: U1.2 v1(19.85,22.8)
  Bottom Layer w0.254: 27.85,15.86 26.65,17.06 26.12,17.06 20.38,22.8 v1(19.85,22.8)
CS: length 15
  Top Layer w0.254: U1.1 v1(17.56,23.45)
  Bottom Layer w0.254: v1(17.56,23.45) 20.48,23.45 26.37,17.56 27.56,17.56 CN2.2
MISO: length 13.7
  Top Layer w0.254: U1.3 v1(17.56,22.15)
  Bottom Layer w0.254: 27.14,15.15 27.14,15.28 20.28,22.15 v1(17.56,22.15)
MOSI: length 11.1
  Top Layer w0.254: U1.4 v1(19.85,21.5)
  Bottom Layer w0.254: CN2.5 25.31,15.57 25.31,16.38 20.19,21.5 v1(19.85,21.5)
PHU:
  vias: v1(36.49,19.21) v1(36.49,18.45) v1(36.49,17.69)
PHV:
  vias: v1(35.22,19.21) v1(35.22,18.45) v1(35.22,17.69)
PHW:
  vias: v1(33.82,19.21) v1(33.82,18.45) v1(33.82,17.69)
$1N873: length 2
  Top Layer w0.254: C2.2 30.18,21.4 U2.4
$1N1089: length 1.6
  Top Layer w0.254: R1.2 40.19,16.92 arc(40.73,16.56) LED1.2

## Copper pours and planes (outline as drawn; the poured copper is in the pictures)
GND on Top Layer: -4.03,46.14 45.25,46.14 45.25,-2.12 -4.03,-2.12
GND on Bottom Layer: -1.23,50.33 49.44,50.33 49.44,-6.69 -1.23,-6.69
PHU on Top Layer: 35.99,19.52 37.07,19.52 37.07,13.46 39.41,11.12 39.41,10.47 37.87,8.93 37.22,8.93 33.57,12.58 33.57,13.26 35.99,15.68
PHU on Bottom Layer: 35.98,19.48 35.99,19.53 36.02,19.57 36.06,19.6 36.11,19.61 37.03,19.61 37.08,19.6 37.12,19.57 37.15,19.53 37.16,19.48 37.16,17.54 37.15,17.49 37.12,17.45 37.08,17.42 37.03,17.41 36.11,17.41 36.06,17.42 36.02,17.45 35.99,17.49 35.98,17.54
PHV on Top Layer: 34.71,19.52 35.58,19.52 35.58,15.94 33.08,13.44 33.08,12.08 36.74,8.42 36.74,7.79 35.2,6.25 34.55,6.25 30.89,9.91 30.89,13.02 34.71,16.84
PHV on Bottom Layer: 34.59,19.48 34.6,19.53 34.63,19.57 34.67,19.6 34.72,19.61 35.56,19.61 35.61,19.6 35.65,19.57 35.68,19.53 35.69,19.48 35.69,17.54 35.68,17.49 35.65,17.45 35.61,17.42 35.56,17.41 34.72,17.41 34.67,17.42 34.63,17.45 34.6,17.49 34.59,17.54
PHW on Top Layer: 33.22,19.52 34.3,19.52 34.3,17.03 30.28,13.02 30.28,9.47 33.96,5.8 33.96,5.13 32.42,3.59 31.72,3.59 28.13,7.18 28.13,12.61 33.22,17.71
PHW on Bottom Layer: 33.12,19.49 33.13,19.54 33.15,19.58 33.19,19.61 33.24,19.61 34.19,19.61 34.24,19.61 34.28,19.58 34.31,19.54 34.32,19.49 34.32,17.54 34.31,17.49 34.28,17.45 34.24,17.43 34.19,17.42 33.24,17.42 33.19,17.43 33.15,17.45 33.13,17.49 33.12,17.54

Small or netless copper shapes (teardrops, artwork), in the pictures only: 30 on Top Layer, 10 on Bottom Layer

## Text on the board
Bottom Silkscreen Layer: V | CS CLK MI MO | G | MOTOR0 | SPI
Top Silkscreen Layer: U  V  W | M2.5x3 | OUTPUT | MOTOR0 | Ver1.1@kkl | AS5047P
